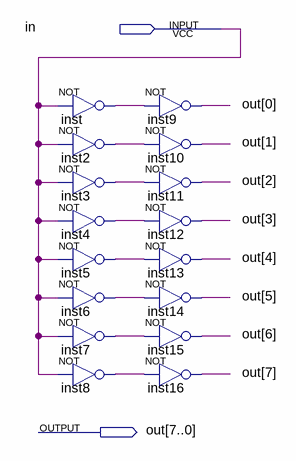
[diagram p0: schematic sheet]
// Quartus schematic extend8.bdf as structural Verilog: 16 symbols, 2 pins
module extend8 (
  input  in,
  output [7:0] out
);

  wire inst2_out, inst3_out, inst4_out, inst5_out, inst6_out, inst7_out, inst8_out, inst_out;

  not inst (inst_out, in);
  not inst2 (inst2_out, in);
  not inst3 (inst3_out, in);
  not inst4 (inst4_out, in);
  not inst5 (inst5_out, in);
  not inst6 (inst6_out, in);
  not inst7 (inst7_out, in);
  not inst8 (inst8_out, in);
  not inst9 (out[0], inst_out);
  not inst10 (out[1], inst2_out);
  not inst11 (out[2], inst3_out);
  not inst12 (out[3], inst4_out);
  not inst13 (out[4], inst5_out);
  not inst14 (out[5], inst6_out);
  not inst15 (out[6], inst7_out);
  not inst16 (out[7], inst8_out);
endmodule
